# Altium schematic sheet Schematic2.SchDoc
size A4; DrawnBy: R.M.S.Madhushan; SheetNumber: 1; SheetTotal: 3
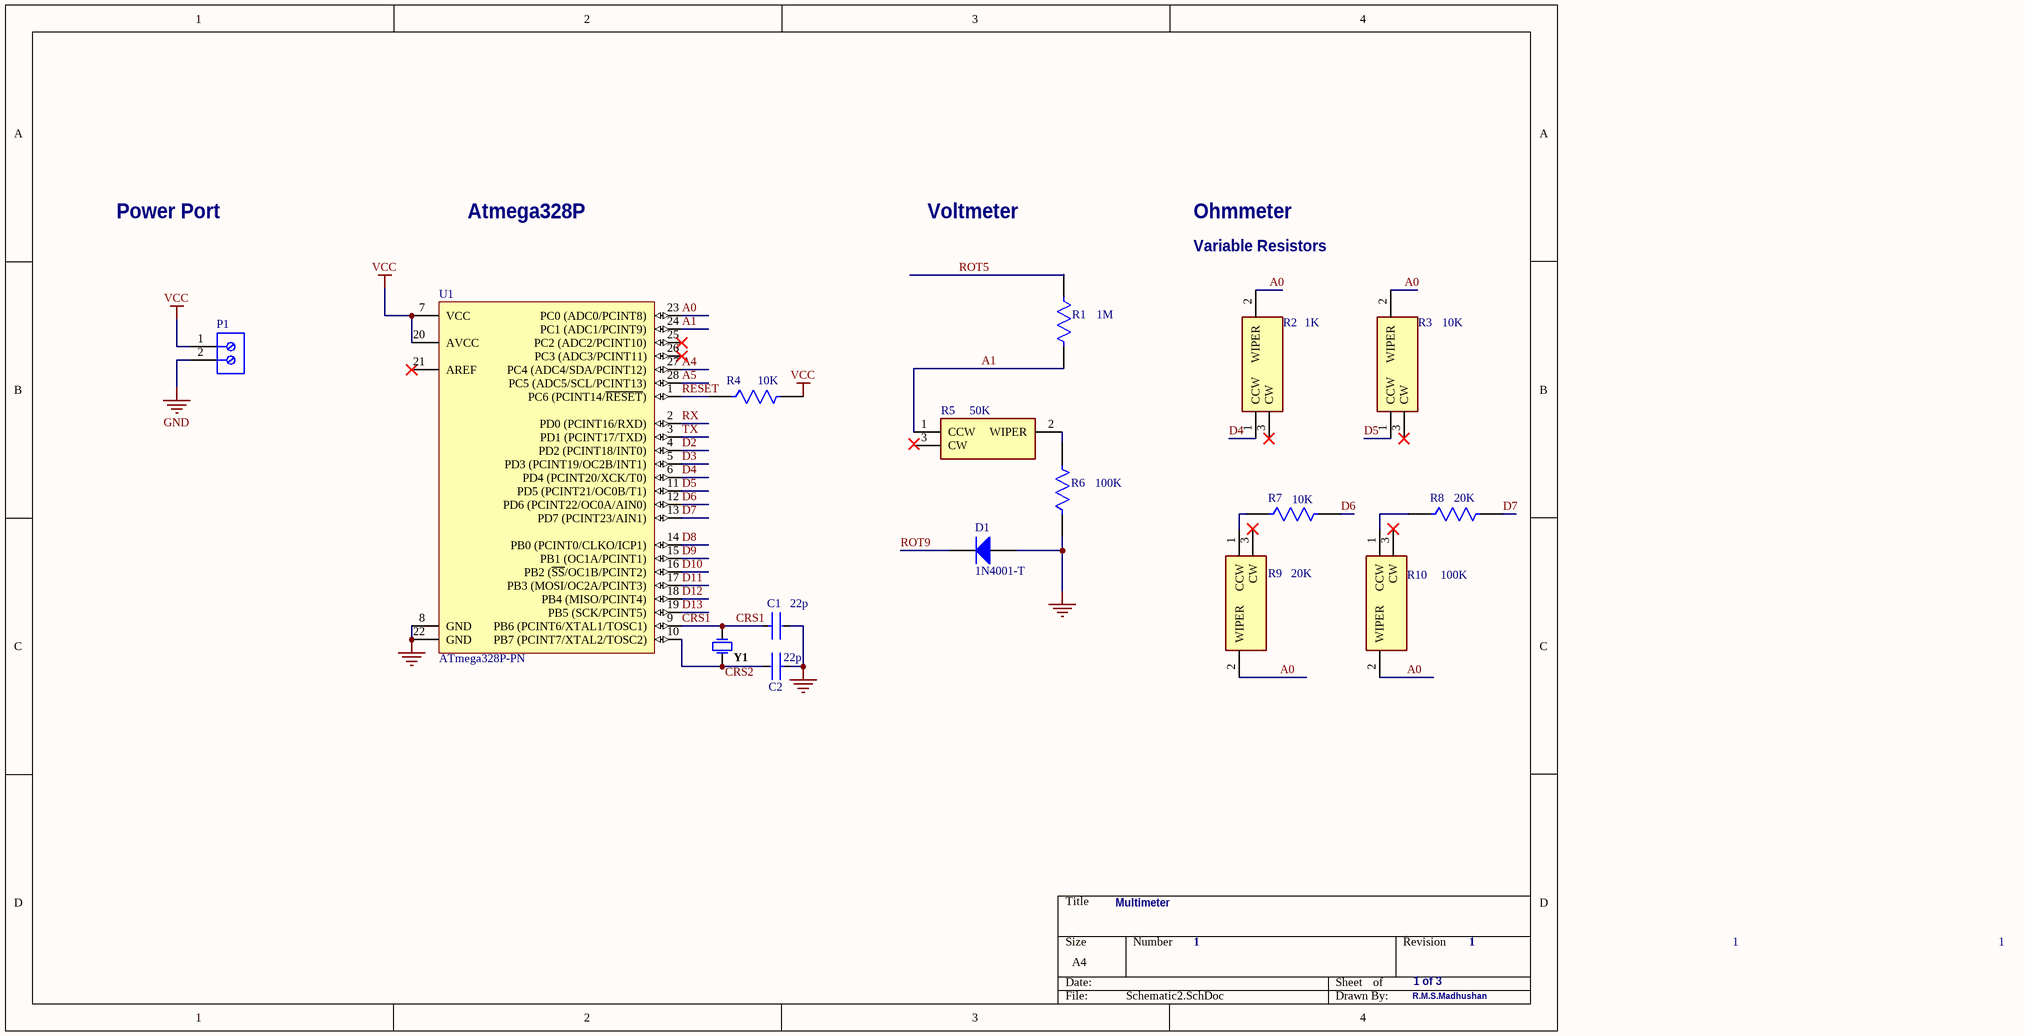
[diagram p0: Schematic2.SchDoc]

## Parts
C1  22p  [FP-RDE0M1-MFG]
C2  22p  [FP-RDE0M1-MFG]
D1  1N4001-T  [DIOD-DO-41-P-2_V]
P1  691214110002  [691214110002]  (value not drawn)
R1  1M  [FP-G001R1000FE1280-MFG]
R2  1K  [3362P_1]
R3  10K  [3362P_1]
R4  10K  [FP-G001R1000FE1280-MFG]
R5  50K  [3362P_1]
R6  100K  [FP-G001R1000FE1280-MFG]
R7  10K  [FP-G001R1000FE1280-MFG]
R8  20K  [FP-G001R1000FE1280-MFG]
R9  20K  [3362P_1]
R10  100K  [3362P_1]
U1  ATmega328P-PN  [28P3]
Y1  FOXSLF/160-20  [FOX-FOXSLF160-20]  (value not drawn)

## Nets
GND: C1.2 C2.1 D1.1(A) P1.2 R6.1 U1.8(GND) U1.22(GND)
VCC: P1.1 R4.2 U1.7(VCC) U1.20(AVCC)
A0: R2.2(WIPER) R3.2(WIPER) R9.2(WIPER) R10.2(WIPER) U1.23(PC0_(ADC0/PCINT8))
A1: R1.2 R5.1(CCW) U1.24(PC1_(ADC1/PCINT9))
A4: U1.27(PC4_(ADC4/SDA/PCINT12))
A5: U1.28(PC5_(ADC5/SCL/PCINT13))
CRS1: C1.1 U1.9(PB6_(PCINT6/XTAL1/TOSC1)) Y1.1
D2: U1.4(PD2_(PCINT18/INT0))
D3: U1.5(PD3_(PCINT19/OC2B/INT1))
D4: R2.1(CCW) U1.6(PD4_(PCINT20/XCK/T0))
D5: R3.1(CCW) U1.11(PD5_(PCINT21/OC0B/T1))
D6: R7.2 U1.12(PD6_(PCINT22/OC0A/AIN0))
D7: R8.2 U1.13(PD7_(PCINT23/AIN1))
D8: U1.14(PB0_(PCINT0/CLKO/ICP1))
D9: U1.15(PB1_(OC1A/PCINT1))
D10: U1.16(PB2_(~{SS}/OC1B/PCINT2))
D11: U1.17(PB3_(MOSI/OC2A/PCINT3))
D12: U1.18(PB4_(MISO/PCINT4))
D13: U1.19(PB5_(SCK/PCINT5))
RESET: R4.1 U1.1(PC6_(PCINT14/~{RESET}))
ROT5: R1.1
ROT9: D1.2(K)
RX: U1.2(PD0_(PCINT16/RXD))
TX: U1.3(PD1_(PCINT17/TXD))
NetC2_2: C2.2 U1.10(PB7_(PCINT7/XTAL2/TOSC2)) Y1.2
NetR5_2: R5.2(WIPER) R6.2
NetR7_1: R7.1 R9.1(CCW)
NetR8_1: R8.1 R10.1(CCW)

Not connected (* = marked no-connect by the designer): R2 3(CW)*; R3 3(CW)*; R5 3(CW); R9 3(CW)*; R10 3(CW)*; U1 21(AREF)* 25(PC2_(ADC2/PCINT10))* 26(PC3_(ADC3/PCINT11))*

## Notes on the sheet
- Power Port
- Atmega328P
- Voltmeter
- Ohmmeter
- Variable Resistors
- Multimeter
- 1
- 1 of 3
- Labels drawn without touching a wire or pin: CRS2

## Library data of the parts
C1 C2 = CMP-06035-055552-1: Ceramic Capacitor 22pF ±5% 50V C0G Radial; Lead Diameter: 0.5mm; Capacitance: 22pF; Width: 0.098inch; Dielectric: C0G; Length: 0.157inch; Max Operating Temperature: 125°C; Case/Package: Radial; Voltage Rating (DC): 50V; Lead Free: Lead Free; Voltage Rating: 50V; Termination: Radial; Mount: Through Hole; Tolerance: 5%; Resistor Type: Ceramic; Packaging: Bulk; Package Quantity: 500; Lead Pitch: 0.197inch; Min Operating Temperature: -55°C; Height - Seated (Max): 0.236inch; Height: 3.5mm
D1 = CMP-0639-00006-2: 1.0 A Rectifier, 15 pF, 50 V, -65 to 150 degC, 2-Pin DO-41 Plastic, RoHS, Tape and Reel; Manufacturer: Diodes Inc; VF (V): 1; CT (pF): 15; Max. IR (uA): 5; VRRM (V): 50; Max. IFSM (A): 30; RoHS: TRUE; Mounting Technology: Through Hole; PartNumber: 1N4001-T; ComponentLink2Description: Datasheet; DatasheetVersion: Rev. 8-2; Operating Temperature Range (degC): -65 to 150; Packing: Tape and Reel; PackageReference: DO-41-P-2; ComponentLink1URL: http://diodes.com/; PackageDescription: 2-Pin Axial Lead, Body 4.635 x 2.36 mm, Lead Spread 25.4 mm; ComponentLink2URL: http://diodes.com/datasheets/ds28002.pdf; Max. Average Rectified Current IO (A): 1; ComponentLink1Description: Manufacturer URL
P1 = CMP-1502-02464-1: Serie 2141 - 3.50 mm Horizontal Entry Modular with Rising Cage Clamp WR-TBL, 2 pin; Manufacturer: Wurth Elektronik; Pin Number: 2; Pitch: 3.50mm; Datasheet URL: http://katalog.we-online.de/em/datasheet/6912141100xx.pdf; Packaging: Box; Mounting Technology: THT; Package Reference: 691214110002; Manufacturer URL: http://www.we-online.de; Part Number: 691214110002; Publisher: WurthElektronik; Operating Temperature: -40to105degC
R1 R4 R6-R8 = CMP-02408-000025-1: Res Wirewound 0.1 Ohm 1% 1W ±90ppm/°C Ceramic Hi Temp Sil AXL Thru-Hole Bulk; Resistance: 100mR; Case/Package: Ceramic; Construction: Cylindrical; Diameter: 2.16mm; Series: G; Tolerance: 1%; Max Operating Temperature: 250°C; Lead Free: Lead Free; Resistor Type: Wirewound; Contact Plating: Tin; Mount: Through Hole; Radiation Hardening: No; RoHS Compliant: Yes; Termination: Axial; Temperature Coefficient: 90ppm/°C; Min Operating Temperature: -65°C; Length: 7.14mm; Military Standard: Not; Packaging: Tape and Reel; Power Rating: 1W
R2 R3 R5 R9 R10 = 3362P-1-203LF: Resistor; Manufacturer_Name: Bourns; Datasheet Link: https://www.bourns.com/docs/Product-Datasheets/3362.pdf; Manufacturer_Part_Number: 3362P-1-203LF; Mouser Part Number: 652-3362P-1-203LF; Mouser Price/Stock: https://www.mouser.co.uk/ProductDetail/Bourns/3362P-1-203LF?qs=GslmPyR0hhF1JBua3W6Xbw%3D%3D; Arrow Part Number: 3362P-1-203LF; Arrow Price/Stock: https://www.arrow.com/en/products/3362p-1-203lf/bourns?region=europe
U1 = CMP-0095-00355-1: 8-bit AVR Microcontroller, 32KB Flash, 1KB EEPROM, 2KB SRAM, 28-pin PDIP, Industrial Grade (-40°C to 105°C); PackageVersion: revB, Sep-2001; ComponentLink1Description: Manufacturer URL; ComponentLink1URL: http://www.atmel.com/; ComponentLink2URL: http://www.atmel.com/dyn/resources/prod_documents/8271.pdf; PackageDescription: 28-lead (0.300"/7.62mm Wide) Plastic Dual Inline Package (PDIP); ComponentLink2Description: ATmega48A/48PA/88A/88PA/168A/168PA/328/328P Datasheet; ComponentLink3Description: ATmega48A/48PA/88A/88PA/168A/168PA/328/328P Summary; DatasheetVersion: revD, May-2011; ComponentLink3URL: http://www.atmel.com/dyn/resources/prod_documents/8271S.pdf; PackageReference: 28P3
Y1 = CMP-1749-00003-1: Resistance Weld Thru-Hole Crystal, 16 MHz, -20 to 70 degC, 2-Pin THD, RoHS, Bulk; Voltage Rating: 250 V; Tolerance: 1%; Resistance: 221 kohm; Case\Package: Axial; Power Rating: 250 mW; RoHSCompliant: true; Package Quantity: 200; Packaging: Bulk; Min Operating Temperature: -55 degC; DatasheetVersion: Mar-15; ComponentLink1URL: http://www.foxonline.com/; Max Operating Temperature: 155 degC; PackageReference: FOXSLF160-20; Mount: Through Hole; PackageDescription: 2-Pin Through Hole Device, Body 11.35 x 4.65 mm; ComponentLink1Description: Manufacturer URL; ComponentLink2URL: http://www.foxonline.com/pdfs/hc49slf.pdf; ComponentLink2Description: Datasheet; Length: 0.248 inch